# EAGLE schematic item_2022_analog_01a (EAGLE 9.6.2)
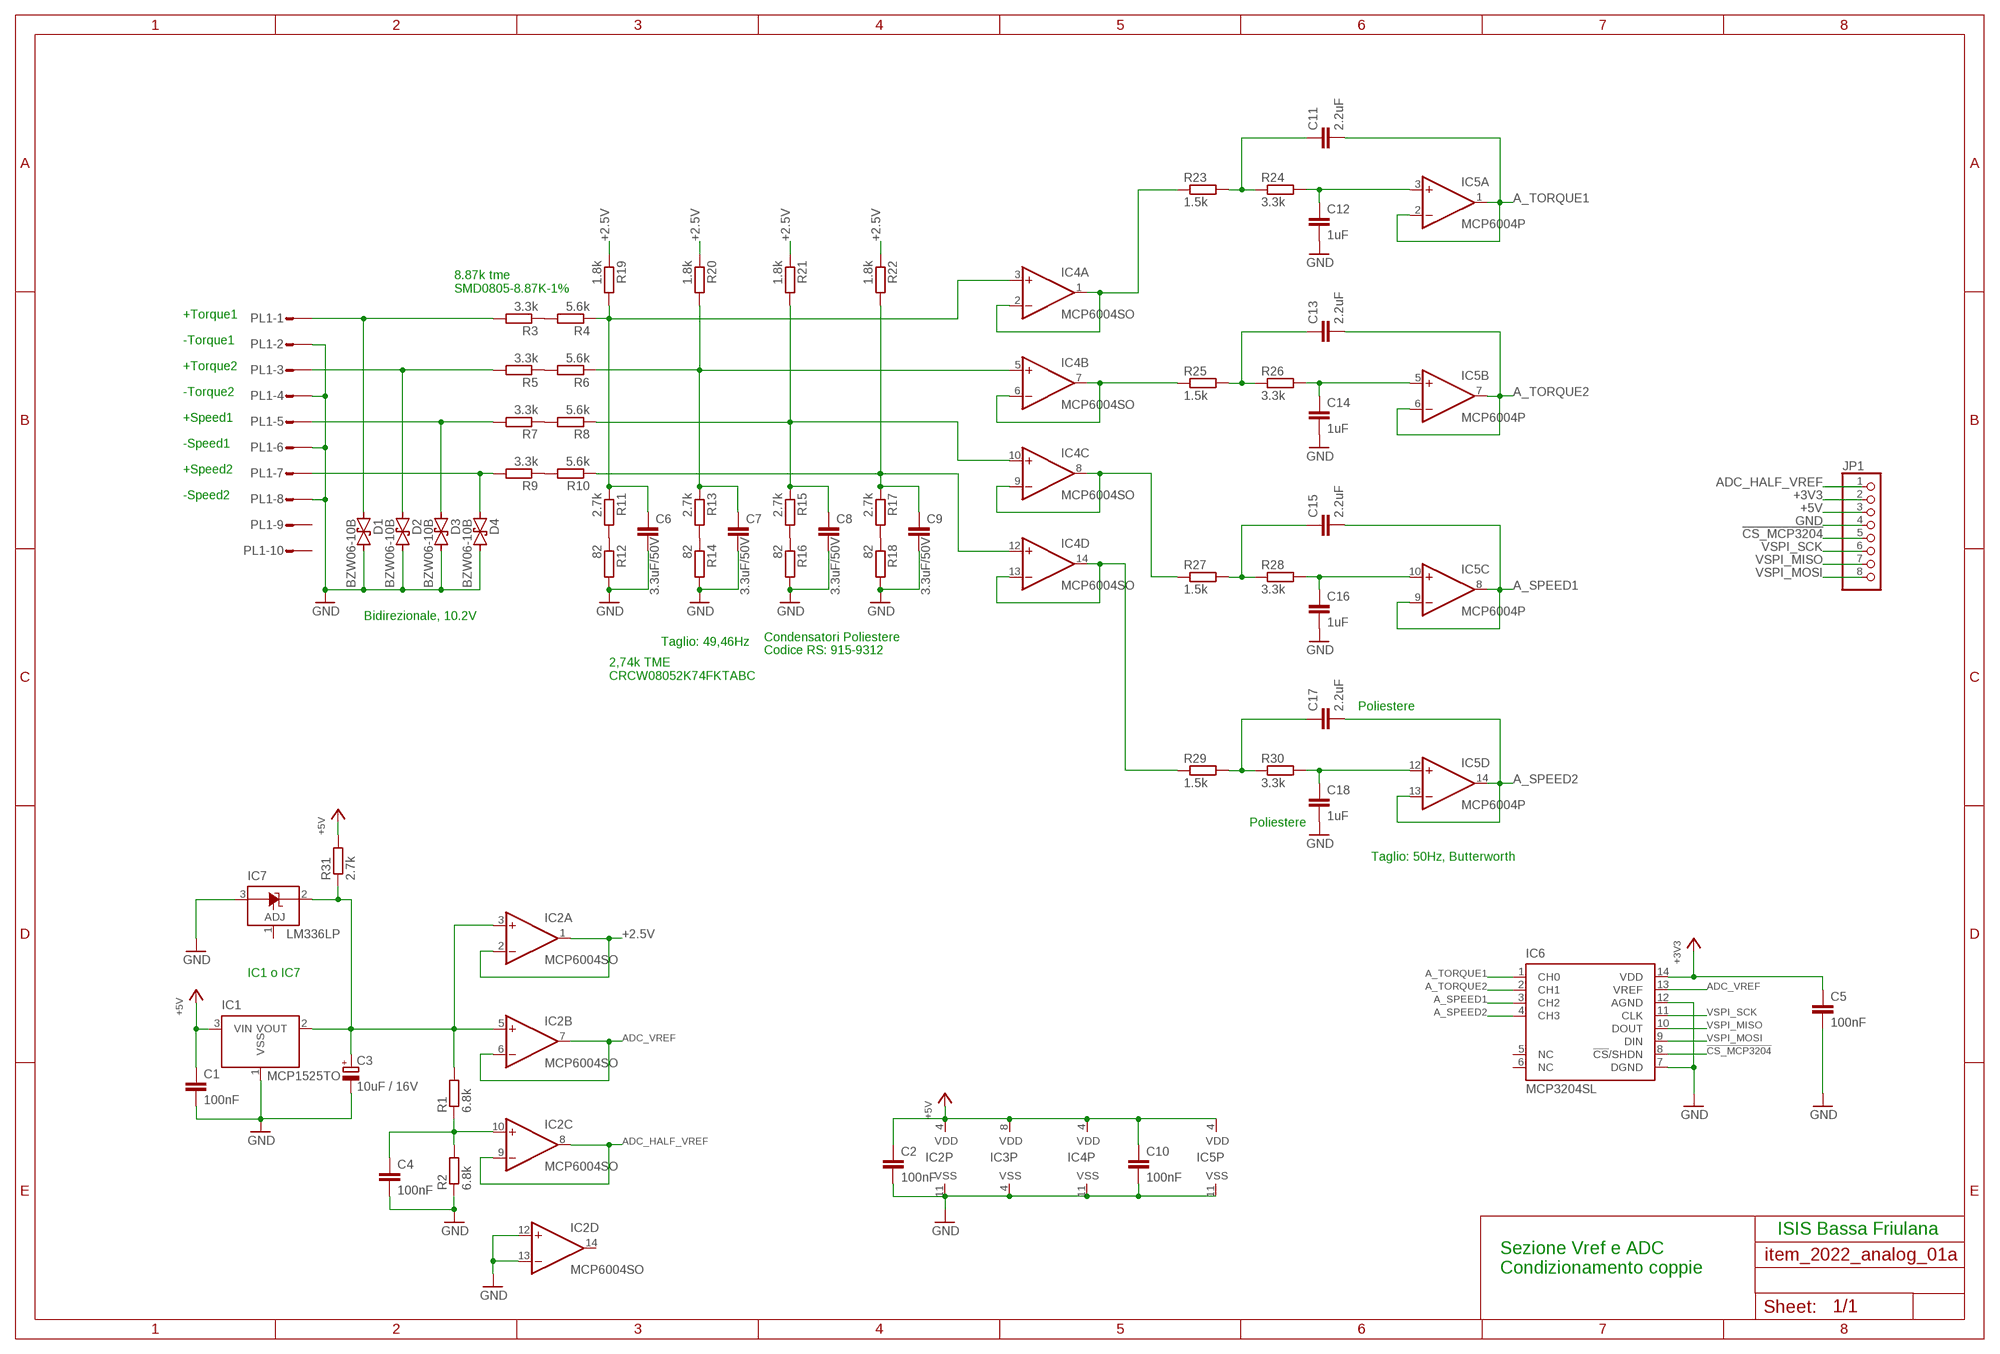
[diagram p0: schematic, sheet 1]

## Parts
C1  100nF  C-EUC0805  [C0805]
C2  100nF  C-EUC0805  [C0805]
C3  10uF / 16V  CPOL-EUE2.5-6  [E2,5-6]
C4  100nF  C-EUC0805  [C0805]
C5  100nF  C-EUC0805  [C0805]
C6  3.3uF/50V  C-EUC0805  [C0805]
C7  3.3uF/50V  C-EUC0805  [C0805]
C8  3.3uF/50V  C-EUC0805  [C0805]
C9  3.3uF/50V  C-EUC0805  [C0805]
C10  100nF  C-EUC0805  [C0805]
C11  2.2uF  C-EUC0805  [C0805]
C12  1uF  C-EUC0805  [C0805]
C13  2.2uF  C-EUC0805  [C0805]
C14  1uF  C-EUC0805  [C0805]
C15  2.2uF  C-EUC0805  [C0805]
C16  1uF  C-EUC0805  [C0805]
C17  2.2uF  C-EUC0805  [C0805]
C18  1uF  C-EUC0805  [C0805]
D1  BZW06-10B  BZW04XXB  [F126Z12]
D2  BZW06-10B  BZW04XXB  [F126Z12]
D3  BZW06-10B  BZW04XXB  [F126Z12]
D4  BZW06-10B  BZW04XXB  [F126Z12]
IC1  MCP1525TO  [TO92]
IC2  MCP6004SO  [SO14]
IC3  MCP6002SO  [SO08]
IC4  MCP6004SO  [SO14]
IC5  MCP6004P  [DIL14]
IC6  MCP3204SL  [SO14]
IC7  LM336LP  [TO92]
JP1  PINHD-1X8  [1X08]
PL1  10VS  [10V]
R1  6.8k  R-EU_R0805  [R0805]
R2  6.8k  R-EU_R0805  [R0805]
R3  3.3k  R-EU_R0805  [R0805]
R4  5.6k  R-EU_0207/10  [0207/10]
R5  3.3k  R-EU_0207/10  [0207/10]
R6  5.6k  R-EU_0207/10  [0207/10]
R7  3.3k  R-EU_0207/10  [0207/10]
R8  5.6k  R-EU_0207/10  [0207/10]
R9  3.3k  R-EU_0207/10  [0207/10]
R10  5.6k  R-EU_0207/10  [0207/10]
R11  2.7k  R-EU_R0805  [R0805]
R12  82  R-EU_R0805  [R0805]
R13  2.7k  R-EU_R0805  [R0805]
R14  82  R-EU_R0805  [R0805]
R15  2.7k  R-EU_R0805  [R0805]
R16  82  R-EU_R0805  [R0805]
R17  2.7k  R-EU_R0805  [R0805]
R18  82  R-EU_R0805  [R0805]
R19  1.8k  R-EU_R0805  [R0805]
R20  1.8k  R-EU_R0805  [R0805]
R21  1.8k  R-EU_R0805  [R0805]
R22  1.8k  R-EU_R0805  [R0805]
R23  1.5k  R-EU_R0805  [R0805]
R24  3.3k  R-EU_R0805  [R0805]
R25  1.5k  R-EU_R0805  [R0805]
R26  3.3k  R-EU_R0805  [R0805]
R27  1.5k  R-EU_R0805  [R0805]
R28  3.3k  R-EU_R0805  [R0805]
R29  1.5k  R-EU_R0805  [R0805]
R30  3.3k  R-EU_R0805  [R0805]
R31  2.7k  R-EU_R0805  [R0805]

## Nets
!CS_MCP3204! [digital]: IC6.8(!CS!/SHDN) JP1.5
+2.5V [supply]: IC2.1(A:OUT) IC2.2(A:-IN) R19.1 R20.1 R21.1 R22.1
+3V3 [supply]: C5.1 IC6.14(VDD) JP1.2
+5V [supply]: C1.1 C2.1 C10.1 IC1.3(VIN) IC2.4(P:VDD) IC3.8(P:VDD) IC4.4(P:VDD) IC5.4(P:VDD) JP1.3 R31.2
A_SPEED1: C15.2 IC5.8(C:OUT) IC5.9(C:-IN) IC6.3(CH2)
A_SPEED2: C17.2 IC5.13(D:-IN) IC5.14(D:OUT) IC6.4(CH3)
A_TORQUE1: C11.2 IC5.1(A:OUT) IC5.2(A:-IN) IC6.1(CH0)
A_TORQUE2: C13.2 IC5.6(B:-IN) IC5.7(B:OUT) IC6.2(CH1)
ADC_HALF_VREF [supply]: IC2.8(C:OUT) IC2.9(C:-IN) JP1.1
ADC_VREF [supply]: IC2.6(B:-IN) IC2.7(B:OUT) IC6.13(VREF)
GND [supply]: C1.2 C2.2 C3.- C4.2 C5.2 C6.2 C7.2 C8.2 C9.2 C10.2 C12.2 C14.2 C16.2 C18.2 D1.C D2.C D3.C D4.C IC1.1(VSS) IC2.11(P:VSS) IC2.12(D:+IN) IC2.13(D:-IN) IC3.4(P:VSS) IC4.11(P:VSS) IC5.11(P:VSS) IC6.7(DGND) IC6.12(AGND) IC7.3(A) JP1.4 PL1.2 PL1.4 PL1.6 PL1.8 R2.1 R12.2 R14.2 R16.2 R18.2
N$2: D1.A PL1.1 R3.2
N$3: C4.1 IC2.10(C:+IN) R1.1 R2.2
N$4: D2.A PL1.3 R5.2
N$5: D3.A PL1.5 R7.2
N$6: D4.A PL1.7 R9.2
N$7: R3.1 R4.2
N$8: R5.1 R6.2
N$9: R7.1 R8.2
N$10: R9.1 R10.2
N$11: R11.2 R12.1
N$12: C6.1 IC4.3(A:+IN) R4.1 R11.1 R19.2
N$13: R13.2 R14.1
N$14: R15.2 R16.1
N$15: R17.2 R18.1
N$16: C7.1 IC4.5(B:+IN) R6.1 R13.1 R20.2
N$17: C8.1 IC4.10(C:+IN) R8.1 R15.1 R21.2
N$18: C9.1 IC4.12(D:+IN) R10.1 R17.1 R22.2
N$19: IC4.1(A:OUT) IC4.2(A:-IN) R23.1
N$20: IC4.6(B:-IN) IC4.7(B:OUT) R25.1
N$21: IC4.8(C:OUT) IC4.9(C:-IN) R27.1
N$22: IC4.13(D:-IN) IC4.14(D:OUT) R29.1
N$23: C11.1 R23.2 R24.1
N$24: C12.1 IC5.3(A:+IN) R24.2
N$25: C3.+ IC1.2(VOUT) IC2.3(A:+IN) IC2.5(B:+IN) IC7.2(C) R1.2 R31.1
N$26: C13.1 R25.2 R26.1
N$27: C14.1 IC5.5(B:+IN) R26.2
N$29: C15.1 R27.2 R28.1
N$30: C16.1 IC5.10(C:+IN) R28.2
N$32: C17.1 R29.2 R30.1
N$33: C18.1 IC5.12(D:+IN) R30.2
VSPI_MISO [digital]: IC6.10(DOUT) JP1.7
VSPI_MOSI [digital]: IC6.9(DIN) JP1.8
VSPI_SCK [digital]: IC6.11(CLK) JP1.6
Unconnected: IC2.14(D:OUT) IC3.1(A:OUT) IC3.2(A:-IN) IC3.3(A:+IN) IC3.5(B:+IN) IC3.6(B:-IN) IC3.7(B:OUT) IC6.5(NC) IC6.6(NC) IC7.1(ADJ) PL1.9 PL1.10

## Notes on the sheet
- 8.87k tme
  SMD0805-8.87K-1%
- +Torque1
- -Torque1
- +Torque2
- -Torque2
- +Speed1
- -Speed1
- +Speed2
- -Speed2
- Bidirezionale, 10.2V
- Taglio: 49,46Hz | Condensatori Poliestere
- Codice RS: 915-9312
- 2,74k TME
  CRCW08052K74FKTABC
- Poliestere
- Poliestere
- Taglio: 50Hz, Butterworth
- IC1 o IC7
- ISIS Bassa Friulana
- Sezione Vref e ADC
  Condizionamento coppie

## Library data of the parts
C1 C2 C4 C5 C10 = rcl_LargePads:C-EU: CAPACITOR, European symbol
C3 = rcl_LargePads:CPOL-EU: POLARIZED CAPACITOR, European symbol
C6-C9 = rcl_LargePads:C-EU: CAPACITOR, European symbol; TME_EU: MKS2B043301H00KSSD
C11 C13 C15 C17 = rcl_LargePads:C-EU: CAPACITOR, European symbol; TME_EU: MKS2B042201F00KSSD
C12 C14 C16 C18 = rcl_LargePads:C-EU: CAPACITOR, European symbol; TME_EU: B32529C0105J189
D1-D4 = diode_LargePads:BZW04XXB: DIODE uni and bidirectional supressor diode
IC1 = MCP1525_MCP1541:MCP1525: MCP1525 - 2.5V Precision Voltage Reference
IC2 IC4 IC5 = MCP6002_MCP6004:MCP6004: MCP6004 - 1 MHz, Low-Power quad Op Amp, Rail-to-Rail Input/Output, Supply Voltage: 1.8V to 6.0V
IC3 = MCP6002_MCP6004:MCP6002: MCP6002 - 1 MHz, Low-Power dual Op Amp, Rail-to-Rail Input/Output, Supply Voltage: 1.8V to 6.0V
IC6 = MCP3204_MCP3208:MCP3204: MCP3204 - 2.7V 4-Channel 12-Bit A/D Converters with SPI Serial Interface
IC7 = linear:LM336: 2.5-V INTEGRATED REFERENCE CIRCUITS LM236 Source: http://focus.ti.com/lit/ds/symlink/lm336-2.5.pdf
JP1 = pinhead:PINHD-1X8: PIN HEADER
PL1 = con-harting-v:10VS: CONNECTOR; OC_FARNELL: unknown; OC_NEWARK: unknown
R1-R30 = rcl_LargePads:R-EU_: RESISTOR, European symbol
R31 = rcl:R-EU_: RESISTOR, European symbol

## Net classes
0 default: width 0.305 mm, drill 0.254 mm, clearance 0.305 mm
1 supply: width 0.356 mm, drill 0.305 mm, clearance 0.305 mm to class 0, clearance 0.305 mm
2 digital: width 0.203 mm, drill 0.254 mm, clearance 0.254 mm to class 0, clearance 0.305 mm to class 1, clearance 0.203 mm